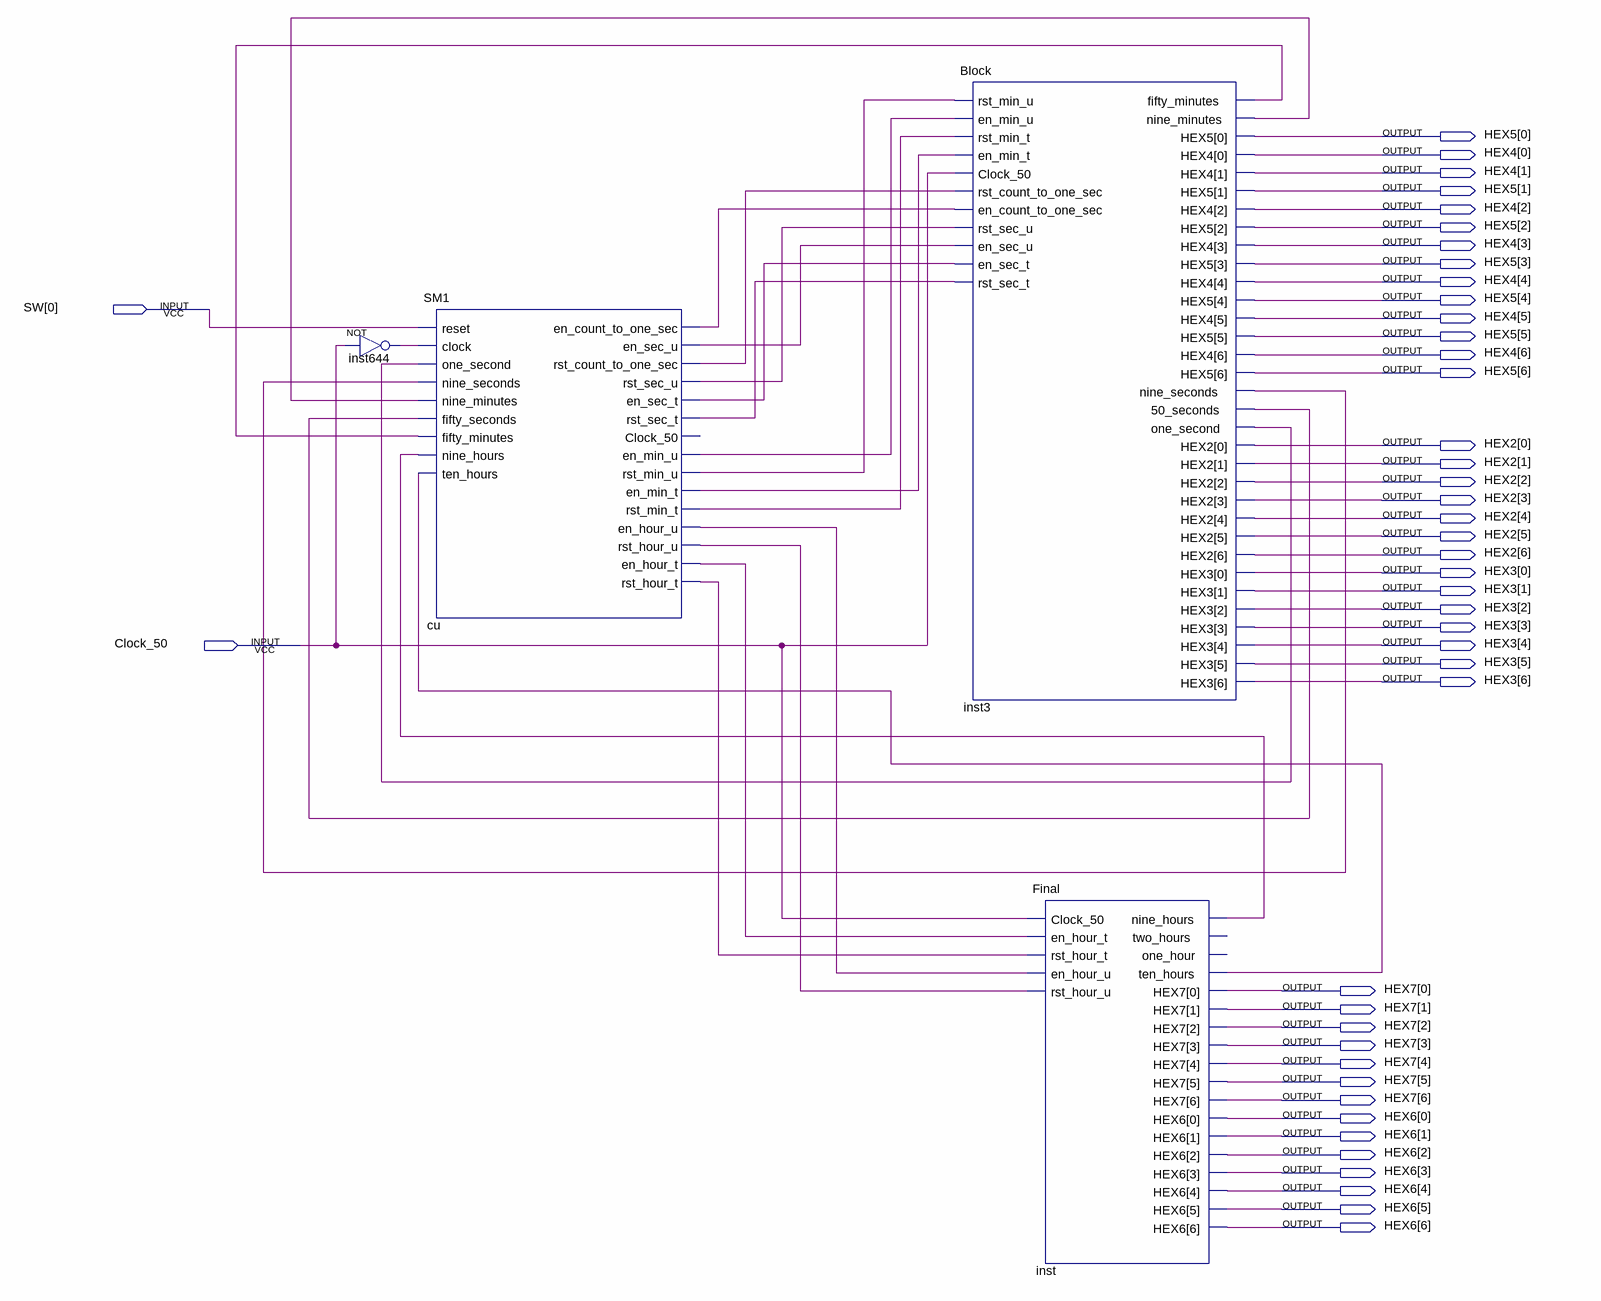
[diagram p0: schematic sheet]
// Quartus schematic Block2.bdf as structural Verilog: 4 symbols, 44 pins
module Block2 (
  input  [0:0] SW,
  input  Clock_50,
  output [6:0] HEX5,
  output [6:0] HEX4,
  output [6:0] HEX2,
  output [6:0] HEX3,
  output [6:0] HEX7,
  output [6:0] HEX6
);

  wire cu_en_count_to_one_sec, cu_en_hour_t, cu_en_hour_u, cu_en_min_t, cu_en_min_u, cu_en_sec_t,
       cu_en_sec_u, cu_rst_count_to_one_sec, cu_rst_hour_t, cu_rst_hour_u, cu_rst_min_t, cu_rst_min_u,
       cu_rst_sec_t, cu_rst_sec_u, inst3_50_seconds, inst3_fifty_minutes, inst3_nine_minutes,
       inst3_nine_seconds, inst3_one_second, inst644_out, inst_nine_hours, inst_ten_hours;

  not inst644 (inst644_out, Clock_50);
  SM1 cu (
    .reset(SW[0]), .clock(inst644_out), .one_second(inst3_one_second), .nine_seconds(inst3_nine_seconds),
    .nine_minutes(inst3_nine_minutes), .fifty_seconds(inst3_50_seconds), .fifty_minutes(inst3_fifty_minutes),
    .nine_hours(inst_nine_hours), .ten_hours(inst_ten_hours), .en_count_to_one_sec(cu_en_count_to_one_sec),
    .en_sec_u(cu_en_sec_u), .rst_count_to_one_sec(cu_rst_count_to_one_sec), .rst_sec_u(cu_rst_sec_u),
    .en_sec_t(cu_en_sec_t), .rst_sec_t(cu_rst_sec_t), .en_min_u(cu_en_min_u), .rst_min_u(cu_rst_min_u),
    .en_min_t(cu_en_min_t), .rst_min_t(cu_rst_min_t), .en_hour_u(cu_en_hour_u), .rst_hour_u(cu_rst_hour_u),
    .en_hour_t(cu_en_hour_t), .rst_hour_t(cu_rst_hour_t));  // open: Clock_50
  Block inst3 (
    .rst_min_u(cu_rst_min_u), .en_min_u(cu_en_min_u), .rst_min_t(cu_rst_min_t), .en_min_t(cu_en_min_t),
    .Clock_50(Clock_50), .rst_count_to_one_sec(cu_rst_count_to_one_sec),
    .en_count_to_one_sec(cu_en_count_to_one_sec), .rst_sec_u(cu_rst_sec_u), .en_sec_u(cu_en_sec_u),
    .en_sec_t(cu_en_sec_t), .rst_sec_t(cu_rst_sec_t), .fifty_minutes(inst3_fifty_minutes),
    .nine_minutes(inst3_nine_minutes), .HEX5(HEX5), .HEX4(HEX4), .nine_seconds(inst3_nine_seconds),
    .\50_seconds (inst3_50_seconds), .one_second(inst3_one_second), .HEX2(HEX2), .HEX3(HEX3));
  Final inst (
    .Clock_50(Clock_50), .en_hour_t(cu_en_hour_t), .rst_hour_t(cu_rst_hour_t), .en_hour_u(cu_en_hour_u),
    .rst_hour_u(cu_rst_hour_u), .nine_hours(inst_nine_hours), .ten_hours(inst_ten_hours), .HEX7(HEX7),
    .HEX6(HEX6));  // open: two_hours, one_hour
endmodule
